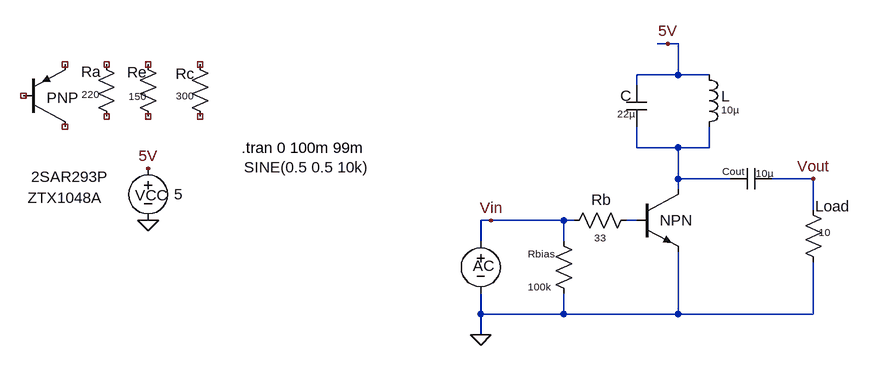
[diagram p0: schematic CLASS C Amplifier.asc]
CLASS C Amplifier.asc, the LTspice schematic file:
Version 4
SHEET 1 880 680
WIRE 240 -112 224 -112
WIRE 256 -112 240 -112
WIRE 256 -64 256 -112
WIRE 256 -64 192 -64
WIRE 304 -64 256 -64
WIRE 192 -48 192 -64
WIRE 192 48 192 16
WIRE 256 48 192 48
WIRE 304 48 304 16
WIRE 304 48 256 48
WIRE 256 96 256 48
WIRE 336 96 256 96
WIRE 464 96 400 96
WIRE 256 112 256 96
WIRE 464 144 464 96
WIRE -32 160 -48 160
WIRE 80 160 -32 160
WIRE 96 160 80 160
WIRE 192 160 176 160
WIRE -48 192 -48 160
WIRE 80 192 80 160
WIRE -48 304 -48 272
WIRE 80 304 80 272
WIRE 80 304 -48 304
WIRE 256 304 256 208
WIRE 256 304 80 304
WIRE 464 304 464 224
WIRE 464 304 256 304
WIRE -48 336 -48 304
FLAG 240 -112 5V
FLAG 464 96 Vout
FLAG -560 80 5V
FLAG -560 160 0
FLAG -32 160 Vin
FLAG -48 336 0
SYMBOL npn 192 112 R0
WINDOW 0 36 48 Left 2
WINDOW 3 -937 13 Left 2
SYMATTR InstName NPN
SYMATTR Value ZTX1048A
SYMBOL res -496 -96 R0
WINDOW 0 -22 30 Left 2
WINDOW 3 -21 64 Left 1
SYMATTR InstName Rc
SYMATTR Value 300
SYMBOL res -576 -96 R0
WINDOW 0 -16 28 Left 2
WINDOW 3 -14 65 Left 1
SYMATTR InstName Re
SYMATTR Value 150
SYMBOL voltage -48 176 R0
WINDOW 123 0 0 Left 0
WINDOW 39 0 0 Left 0
WINDOW 0 -12 54 Left 2
WINDOW 3 -364 -98 Left 2
SYMATTR InstName AC
SYMATTR Value SINE(0.5 0.5 10k)
SYMBOL voltage -560 64 R0
WINDOW 0 -20 57 Left 2
WINDOW 3 40 56 Left 2
WINDOW 123 0 0 Left 0
WINDOW 39 0 0 Left 0
SYMATTR InstName VCC
SYMATTR Value 5
SYMBOL pnp -752 16 M180
WINDOW 0 36 45 Left 2
WINDOW 3 12 -77 Left 2
SYMATTR InstName PNP
SYMATTR Value 2SAR293P
SYMBOL res 448 128 R0
WINDOW 0 19 10 Left 2
WINDOW 3 24 50 Left 1
SYMATTR InstName Load
SYMATTR Value 10
SYMBOL res -640 -96 R0
WINDOW 0 -23 27 Left 2
WINDOW 3 -22 62 Left 1
SYMATTR InstName Ra
SYMATTR Value 220
SYMBOL res 64 176 R0
WINDOW 0 -39 35 Left 1
WINDOW 3 -39 86 Left 1
SYMATTR InstName Rbias
SYMATTR Value 100k
SYMBOL cap 208 16 R180
WINDOW 0 24 48 Left 2
WINDOW 3 19 20 Left 1
SYMATTR InstName C
SYMATTR Value 22µ
SYMATTR SpiceLine V=50
SYMBOL ind 288 -80 R0
WINDOW 3 34 70 Left 1
WINDOW 0 34 49 Left 2
SYMATTR Value 10µ
SYMATTR InstName L
SYMATTR SpiceLine Ipk=20 Rser=0.0105 Rpar=7827 Cpar=24.013p
SYMBOL cap 400 80 R90
WINDOW 0 15 59 VBottom 1
WINDOW 3 -3 11 VTop 1
SYMATTR InstName Cout
SYMATTR Value 10µ
SYMBOL res 192 144 R90
WINDOW 0 0 54 VBottom 2
WINDOW 3 32 56 VTop 1
SYMATTR InstName Rb
SYMATTR Value 33
TEXT -416 48 Left 2 !.tran 0 100m 99m

The netlist it stands for:
* CLASS C Amplifier.asc
Q§NPN N001 N002 0 0 ZTX1048A
Rc NC_01 NC_02 300
Re NC_03 NC_04 150
V§AC Vin 0 SINE(0.5 0.5 10k)
VCC 5V 0 5
Q§PNP NC_05 NC_06 NC_07 0 2SAR293P
R§Load Vout 0 10
Ra NC_08 NC_09 220
Rbias Vin 0 100k
C N001 5V 22µ V=50
L 5V N001 10µ Ipk=20 Rser=0.0105 Rpar=7827 Cpar=24.013p
Cout Vout N001 10µ
Rb N002 Vin 33
.model NPN NPN
.model PNP PNP
.lib standard.bjt
.tran 0 100m 99m
.backanno
.end